# EAGLE design DexterVp932Adapter (EAGLE 7.7.0)
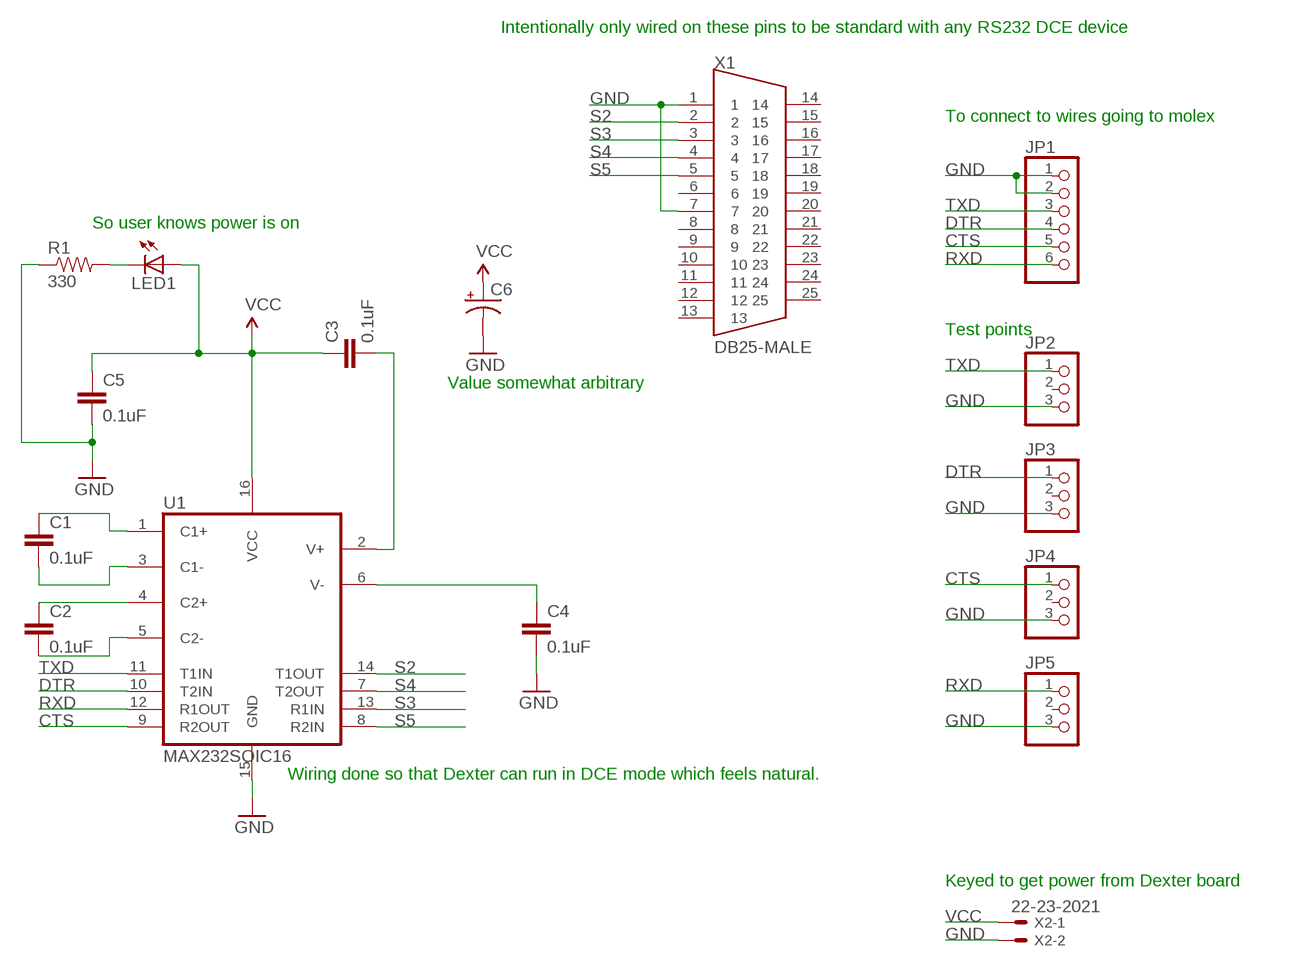
[diagram p0: schematic, sheet 1]

## Parts
C1  0.1uF  CAP1206  [1206]
C2  0.1uF  CAP1206  [1206]
C3  0.1uF  CAP1206  [1206]
C4  0.1uF  CAP1206  [1206]
C5  0.1uF  CAP1206  [1206]
C6  CAP_POLPTH2  [CPOL-RADIAL-10UF-25V]
JP1  PINHD-1X6  [1X06]
JP2  PINHD-1X3  [1X03]
JP3  PINHD-1X3  [1X03]
JP4  PINHD-1X3  [1X03]
JP5  PINHD-1X3  [1X03]
LED1  LED1206  [LED-1206]
R1  330  RESISTOR1206  [1206]
U1  MAX232SOIC16  [SO016]
X1  DB25-MALE  [DB25-MALE]
X2  22-23-2021  [22-23-2021]

## Nets
CTS: JP1.5 JP4.1 U1.9(R2OUT)
DTR: JP1.4 JP3.1 U1.10(T2IN)
FDFG: C2.2 U1.5(C2-)
GND: C4.2 C5.2 C6.2(-) JP1.1 JP1.2 JP2.3 JP3.3 JP4.3 JP5.3 R1.1 U1.15(GND) X1.1 X1.7 X2.2
N$1: C1.1 U1.1(C1+)
N$2: C1.2 U1.3(C1-)
N$3: C2.1 U1.4(C2+)
N$4: LED1.C R1.2
N$5: C4.1 U1.6(V-)
N$6: C3.2 U1.2(V+)
RXD: JP1.6 JP5.1 U1.12(R1OUT)
S2: U1.14(T1OUT) X1.2
S3: U1.13(R1IN) X1.3
S4: U1.7(T2OUT) X1.4
S5: U1.8(R2IN) X1.5
TXD: JP1.3 JP2.1 U1.11(T1IN)
VCC: C3.1 C5.1 C6.1(+) LED1.A U1.16(VCC) X2.1
Unconnected: JP2.2 JP3.2 JP4.2 JP5.2 X1.6 X1.8 X1.9 X1.10 X1.11 X1.12 X1.13 X1.14 X1.15 X1.16 X1.17 X1.18 X1.19 X1.20 X1.21 X1.22 X1.23 X1.24 X1.25

## Notes on the sheet
- Intentionally only wired on these pins to be standard with any RS232 DCE device
- To connect to wires going to molex
- So user knows power is on
- Test points
- Value somewhat arbitrary
- Wiring done so that Dexter can run in DCE mode which feels natural.
- Keyed to get power from Dexter board

## Library data of the parts
C1-C5 = SparkFun:CAP: Capacitor Standard 0603 ceramic capacitor, and 0.1" leaded capacitor.
C6 = SparkFun:CAP_POL: Capacitor Polarized These are standard SMD and PTH capacitors. Normally 10uF, 47uF, and 100uF in electrolytic and tantalum varieties. Always verify the external diameter of the through hole cap, it varies with capacity, voltage, and manufacturer. The EIA devices should be standard.
JP1 = pinhead:PINHD-1X6: PIN HEADER
JP2-JP5 = pinhead:PINHD-1X3: PIN HEADER
LED1 = SparkFun:LED: LEDs Standard schematic elements and footprints for 5mm, 3mm, 1206, and 0603 sized LEDs. 5mm - Spark Fun Electronics SKU : COM-00529 (and others)
R1 = SparkFun:RESISTOR: Resistor Basic schematic elements and footprints for 0603, 1206, and PTH resistors.
U1 = SparkFun:MAX232: RS232 Transceiver Very common IC. This is generically called 'MAX232', but works with the 3V equivalent MAX3232 generic ICs. Field tested and mother approved. Spark Fun Electronics SKU : COM-00316 (DIP) and COM-00589 (SMD)
X1 = mpo:DB25-MALE
X2 = con-molex:22-23-2021: .100" (2.54mm) Center Header - 2 Pin; MF: MOLEX; MPN: 22-23-2021; OC_FARNELL: 1462926; OC_NEWARK: 25C3832

## Board
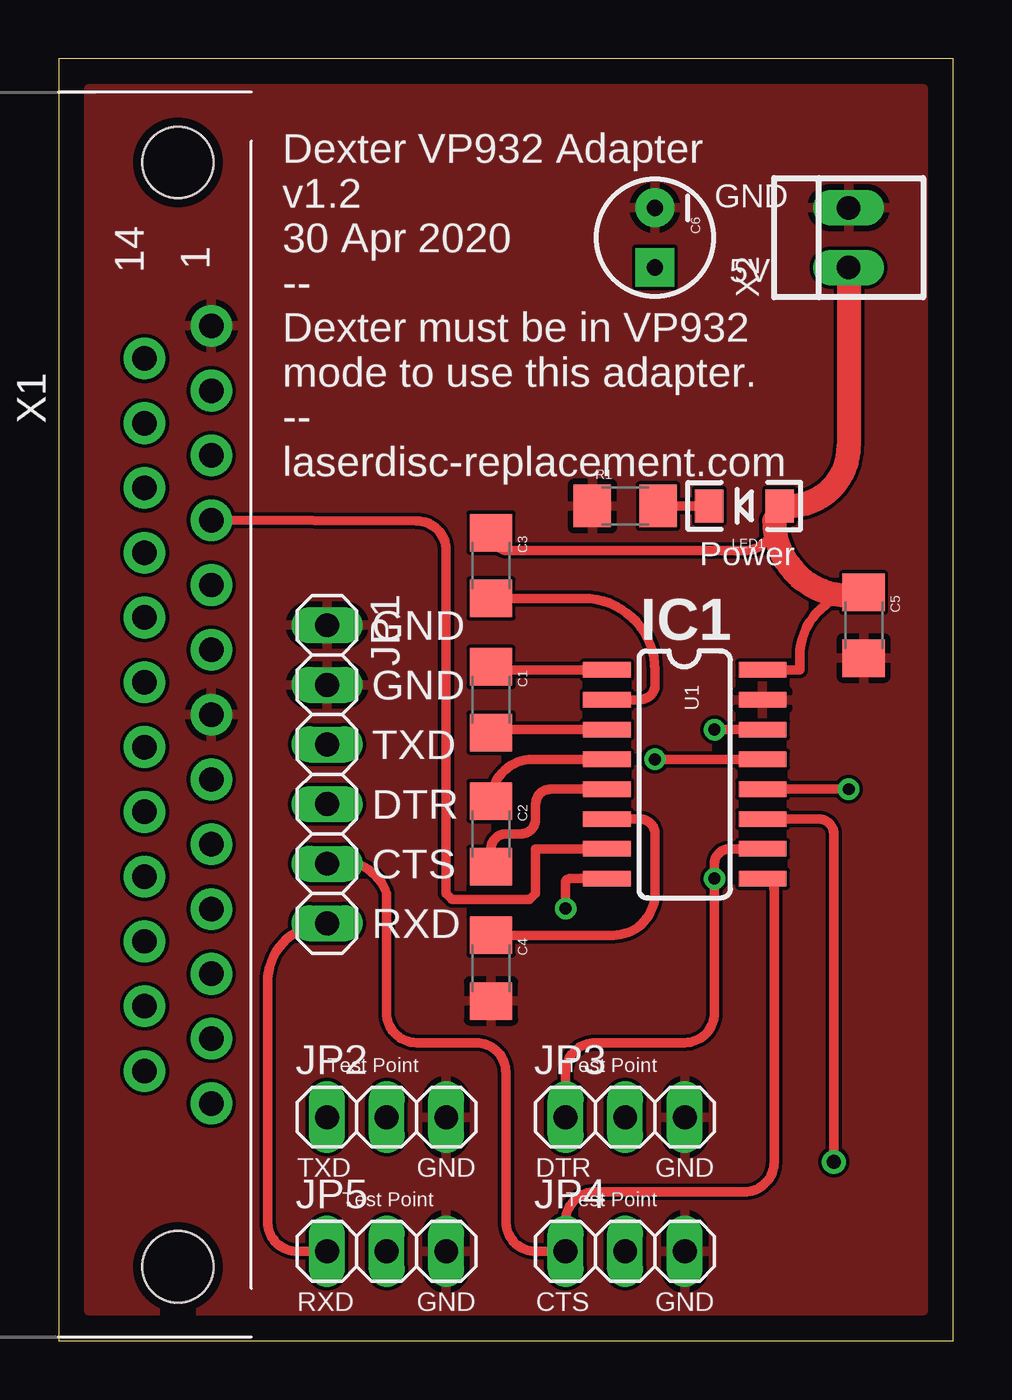
[diagram p1: board, top side]
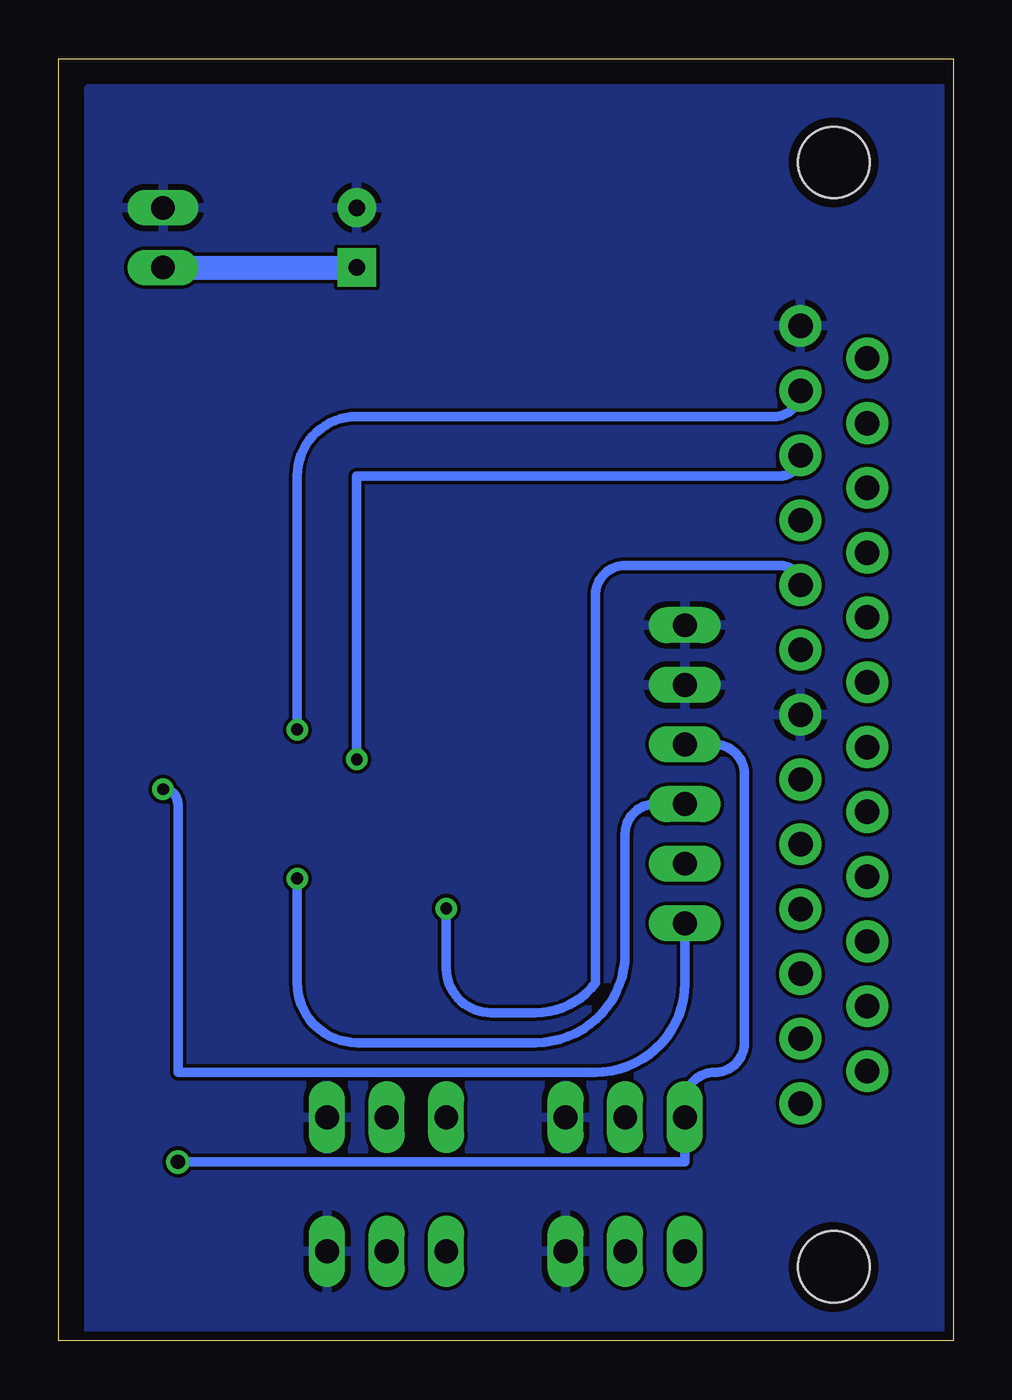
[diagram p2: board, bottom side, seen from below]

Size 38.1 x 54.61 mm. Coordinates in mm from the lower left corner, seen from the top.
Outline: 0,0 38.1,0 38.1,54.61 0,54.61 0,0
Copper layers (1*16): Top 0.035559375mm / dielectric 1.501140625mm / Bottom 0.035559375mm
Design rules "typical_4pcb": minimum track width 10mil, minimum drill 15mil, track to track 6mil, track to pad 6mil, pad to pad 6mil, via to via 6mil, smd to smd 6mil, copper to edge 15mil, drill to drill 8mil, minimum pad ring 10mil, minimum via ring 8mil, stop-mask expansion 4mil, vias tented up to drill 0mil, thermal gap 10mil

### Footprints (pad centres in the part's own frame; a part is rotated, then mirrored left to right if it is on the bottom)
1206 = smd 1.6 x 1.8: 1 -1.4,0; 2 1.4,0
CPOL-RADIAL-10UF-25V = drill 0.7 pad 1.651 square: 1 1.27,0 | drill 0.7 pad 1.651: 2 -1.27,0
1X06 = drill 1.016 long: 1 -6.35,0; 2 -3.81,0; 3 -1.27,0; 4 1.27,0; 5 3.81,0; 6 6.35,0
1X03 = drill 1.016 long: 1 -2.54,0; 2 0,0; 3 2.54,0
LED-1206 = smd 1.2 x 1.4: A -1.5,0; C 1.5,0
SO016 = smd 0.66 x 2.032: 1 -4.445,-3.315; 2 -3.175,-3.315; 3 -1.905,-3.315; 4 -0.635,-3.315; 5 0.635,-3.315; 6 1.905,-3.315; 7 3.175,-3.315; 8 4.445,-3.315; 9 4.445,3.315; 10 3.175,3.315; 11 1.905,3.315; 12 0.635,3.315; 13 -0.635,3.315; 14 -1.905,3.315; 15 -3.175,3.315; 16 -4.445,3.315
DB25-MALE = drill 1.041 pad 1.778: 1 16.561,-1.422; 2 13.801,-1.422; 3 11.04,-1.422; 4 8.28,-1.422; 5 5.52,-1.422; 6 2.76,-1.422; 7 0,-1.422; 8 -2.76,-1.422; 9 -5.52,-1.422; 10 -8.28,-1.422; 11 -11.04,-1.422; 12 -13.801,-1.422; 13 -16.561,-1.422; 14 15.171,1.422; 15 12.417,1.422; 16 9.658,1.422; 17 6.898,1.422; 18 4.139,1.422; 19 1.38,1.422; 20 -1.38,1.422; 21 -4.139,1.422; 22 -6.898,1.422; 23 -9.658,1.422; 24 -12.417,1.422; 25 -15.182,1.422 | hole 3.048: -23.52,0; 23.52,0
22-23-2021 = drill 1 long: 1 -1.27,0; 2 1.27,0

### Placement (x,y rotation side)
C1  18.41,27.3 270 top
C2  18.41,21.59 270 top
C3  18.41,33.02 270 top
C4  18.41,15.88 270 top
C5  34.29,30.48 270 top
C6  25.4,46.99 270 top
JP1  11.43,24.13 270 top
JP2  13.97,9.53 0 top
JP3  24.13,9.53 0 top
JP4  24.13,3.81 0 top
JP5  13.97,3.81 0 top
LED1  29.21,35.56 180 top
R1  24.13,35.56 0 top
U1  26.67,24.13 270 top
X1  5.08,26.67 90 top
X2  33.66,46.99 90 top

### Tracks (layer width: path | path; a pad name or v marks a point on that pad's centre or on a via)
CTS
  Top 0.406: JP1.5 arc-90 13.97,19.05 13.97,13.97 arc90 15.24,12.7 17.78,12.7 arc-90 19.05,11.43 19.05,5.08 arc90 20.32,3.81 JP4.1 21.59,5.08 arc-90 22.86,6.35 29.21,6.35 arc90 30.48,7.62 30.48,19.19 arc90 U1.9
DTR  (via drill 0.51)
  Top 0.406: JP3.1 21.59,11.43 arc-90 22.86,12.7 26.67,12.7 arc90 27.94,13.97 v27.94,19.68 27.94,20.32 arc-90 28.57,20.95 U1.10
  Bottom 0.406: JP1.4 12.7,22.86 arc-90 13.97,21.59 13.97,16.51 arc90 17.78,12.7 25.4,12.7 arc90 27.94,15.24 v27.94,19.68
FDFG
  Top 0.406: C2.2 18.41,20.95 arc-90 19.05,21.59 19.68,21.59 arc90 20.32,22.23 20.32,22.86 arc-90 20.95,23.5 U1.5
GND
  pour Bottom: 0,53.34 36.83,53.34 36.83,0 0,0
  pour Top: 1.27,53.34 36.83,53.34 36.83,1.27 1.27,1.27
N$1
  Top 0.254: 18.55,28.57 C1.1
  Top 0.406: C1.1 18.55,28.7 | 18.55,28.57 arc-90 C1.1 | U1.1 18.55,28.57 | 18.55,28.57 arc-90 C1.1
N$2
  Top 0.254: 18.55,26.04 C1.2
  Top 0.406: 18.55,26.04 arc90 C1.2 arc-90 18.55,26.04 | U1.3 18.55,26.04
N$3
  Top 0.406: C2.1 arc-90 20.19,24.77 U1.4
N$4
  Top 0.406: LED1.C R1.2
N$5
  Top 0.406: C4.1 23.62,17.27 arc90 25.4,19.05 25.4,21.59 arc90 24.77,22.23 U1.6
N$6
  Top 0.406: C3.2 22.36,31.62 arc-90 25.4,28.57 25.4,27.94 arc-90 24.77,27.3 U1.2
RXD  (via drill 0.51)
  Top 0.406: JP5.1 10.16,3.81 arc-90 8.89,5.08 8.89,15.24 arc-90 JP1.6 | U1.12 v33.66,23.5
  Bottom 0.406: JP1.6 11.43,15.24 arc90 15.24,11.43 33.02,11.43 33.02,22.86 arc-90 v33.66,23.5
S2  (via drill 0.51)
  Top 0.406: U1.14 v27.94,26.04
  Bottom 0.406: v27.94,26.04 27.94,36.83 arc90 25.4,39.37 7.6,39.37 arc-90 X1.2
S3  (via drill 0.51)
  Top 0.406: U1.13 v25.4,24.77
  Bottom 0.406: v25.4,24.77 25.4,36.83 7.38,36.83 arc-90 X1.3
S4
  Top 0.406: X1.4 15.24,34.92 arc-90 16.51,33.66 16.51,19.05 16.76,18.8 20.07,18.8 20.32,19.05 20.32,20.95 U1.7
S5  (via drill 0.51)
  Top 0.406: v21.59,18.41 21.59,19.51 arc-90 21.77,19.68 U1.8
  Bottom 0.406: X1.5 arc-90 7.33,33.02 13.97,33.02 arc-90 15.24,31.75 15.24,15.24 arc53 17.78,13.97 19.68,13.97 arc90 21.59,15.88 v21.59,18.41
TXD  (via drill 0.6)
  Top 0.406: v33.02,7.62 33.02,21.59 arc90 32.38,22.23 U1.11
  Bottom 0.406: JP1.3 10.16,25.4 arc90 8.89,24.13 8.89,12.7 arc90 10.16,11.43 arc-90 11.43,10.16 JP2.1 11.43,7.62 v33.02,7.62
VCC
  Top 0.406: LED1.A arc90 30.48,35.33 30.48,34.92 arc-90 29.21,33.66 19.18,33.66 arc-90 C3.1 | 33.66,31.75 34.16,31.75 arc90 C5.1 arc90 31.57,29.16 31.57,28.57 U1.16
  Top 1.016: X2.1 33.66,38.1 arc-90 31.11,35.56 LED1.A | 30.48,34.92 arc90 33.66,31.75
  Bottom 1.016: X2.1 C6.1

### Text on the board
tPlace: GND | 5V | Dexter VP932 Adapter / v1.2 / 30 Apr 2020 / -- / Dexter must be in VP932 / mode to use this adapter. / -- / laserdisc-replacement.com | Power | GND | IC1 | GND | TXD | DTR | CTS | RXD | Test Point | Test Point | TXD | GND | DTR | GND | Test Point | Test Point | RXD | GND | CTS | GND